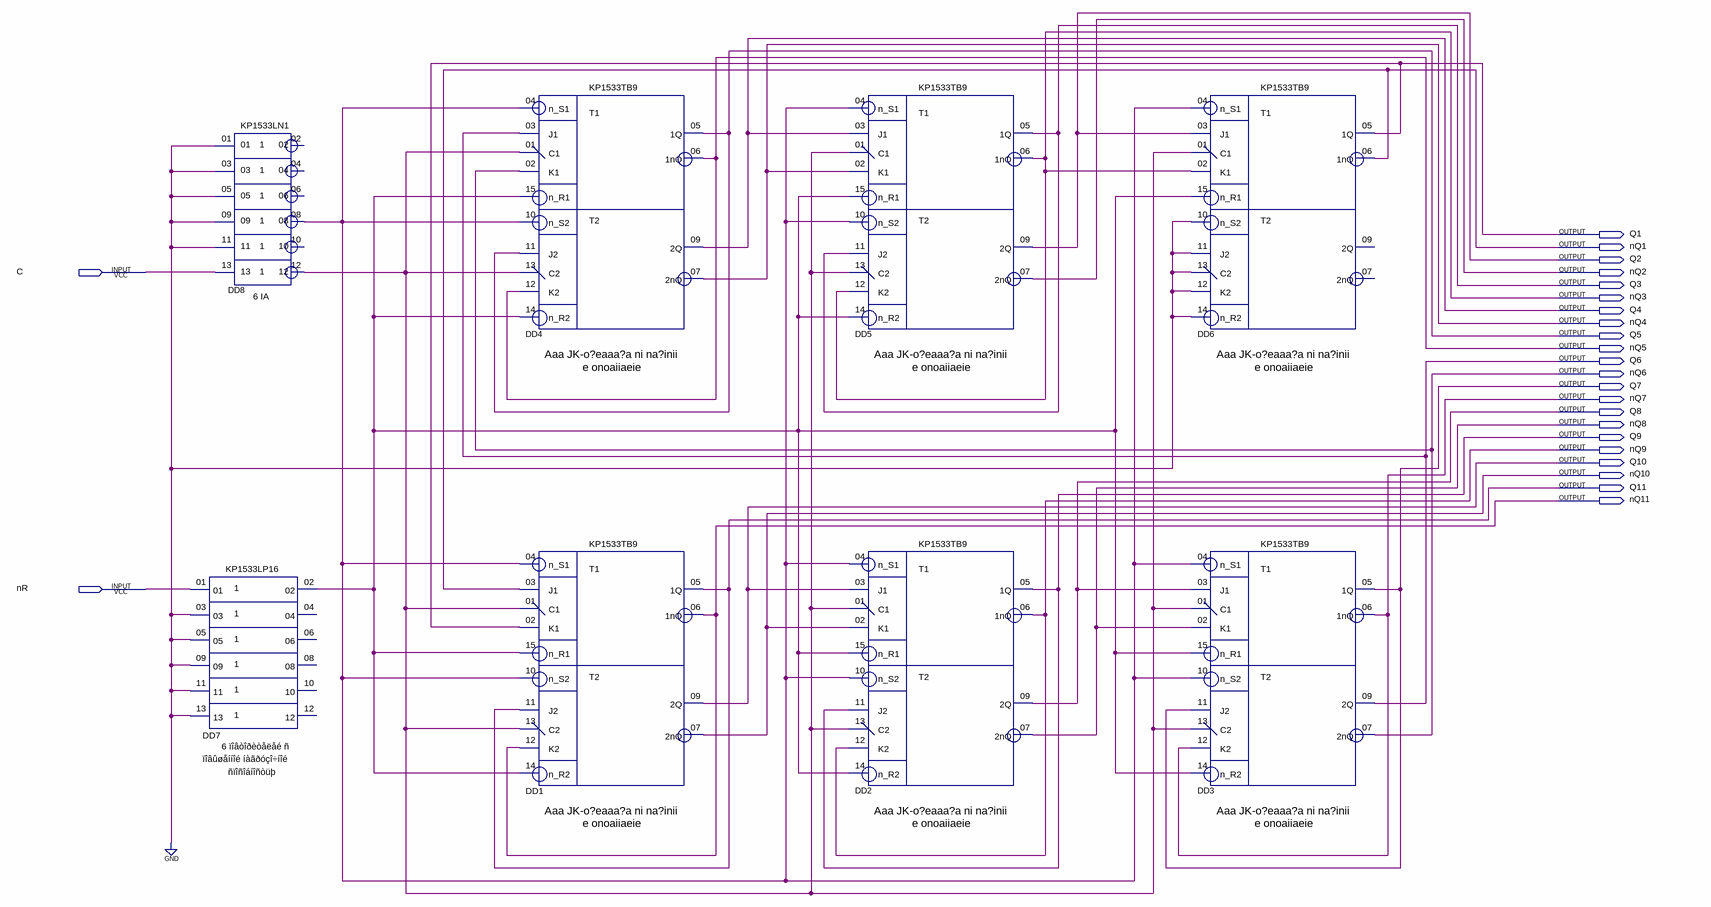
[diagram p0: schematic sheet]
// Quartus schematic JohnsonCounterJKFF.bdf as structural Verilog: 8 symbols, 24 pins
module JohnsonCounterJKFF (
  input  C,
  input  nR,
  output Q1,
  output nQ1,
  output Q2,
  output nQ2,
  output Q3,
  output nQ3,
  output Q4,
  output nQ4,
  output Q5,
  output nQ5,
  output Q6,
  output nQ6,
  output Q7,
  output nQ7,
  output Q8,
  output nQ8,
  output Q9,
  output nQ9,
  output Q10,
  output nQ10,
  output Q11,
  output nQ11
);

  wire DD7_02, DD8_08, DD8_12;

  KP1533LN1 DD8 (
    .\01 (1'b0), .\03 (1'b0), .\05 (1'b0), .\09 (1'b0), .\11 (1'b0), .\13 (C), .\08 (DD8_08), .\12 (DD8_12));  // open: 02, 04, 06, 10
  KP1533LP16 DD7 (
    .\01 (nR), .\03 (1'b0), .\05 (1'b0), .\09 (1'b0), .\11 (1'b0), .\13 (1'b0), .\02 (DD7_02));  // open: 04, 06, 08, 10, 12
  KP1533TB9 DD4 (
    .n_S1(DD8_08), .J1(Q6), .n_R1(DD7_02), .C1(DD8_12), .K1(nQ6), .n_S2(DD8_08), .J2(Q5), .n_R2(DD7_02),
    .C2(DD8_12), .K2(nQ5), .\1Q (Q5), .\1nQ (nQ5), .\2Q (Q4), .\2nQ (nQ4));
  KP1533TB9 DD1 (
    .n_S1(DD8_08), .J1(nQ1), .n_R1(DD7_02), .C1(DD8_12), .K1(Q1), .n_S2(DD8_08), .J2(Q11), .n_R2(DD7_02),
    .C2(DD8_12), .K2(nQ11), .\1Q (Q11), .\1nQ (nQ11), .\2Q (Q10), .\2nQ (nQ10));
  KP1533TB9 DD5 (
    .n_S1(DD8_08), .J1(Q4), .n_R1(DD7_02), .C1(DD8_12), .K1(nQ4), .n_S2(DD8_08), .J2(Q3), .n_R2(DD7_02),
    .C2(DD8_12), .K2(nQ3), .\1Q (Q3), .\1nQ (nQ3), .\2Q (Q2), .\2nQ (nQ2));
  KP1533TB9 DD2 (
    .n_S1(DD8_08), .J1(Q10), .n_R1(DD7_02), .C1(DD8_12), .K1(nQ10), .n_S2(DD8_08), .J2(Q9), .n_R2(DD7_02),
    .C2(DD8_12), .K2(nQ9), .\1Q (Q9), .\1nQ (nQ9), .\2Q (Q8), .\2nQ (nQ8));
  KP1533TB9 DD6 (
    .n_S1(DD8_08), .J1(Q2), .n_R1(DD7_02), .C1(DD8_12), .K1(nQ3), .n_S2(1'b0), .J2(1'b0), .n_R2(1'b0),
    .C2(1'b0), .K2(1'b0), .\1Q (Q1), .\1nQ (nQ1));  // open: 2Q, 2nQ
  KP1533TB9 DD3 (
    .n_S1(DD8_08), .J1(Q8), .n_R1(DD7_02), .C1(DD8_12), .K1(nQ8), .n_S2(DD8_08), .J2(Q7), .n_R2(DD7_02),
    .C2(DD8_12), .K2(nQ7), .\1Q (Q7), .\1nQ (nQ7), .\2Q (Q6), .\2nQ (nQ6));
endmodule
